# EAGLE schematic extruder-controller (EAGLE 5.06)
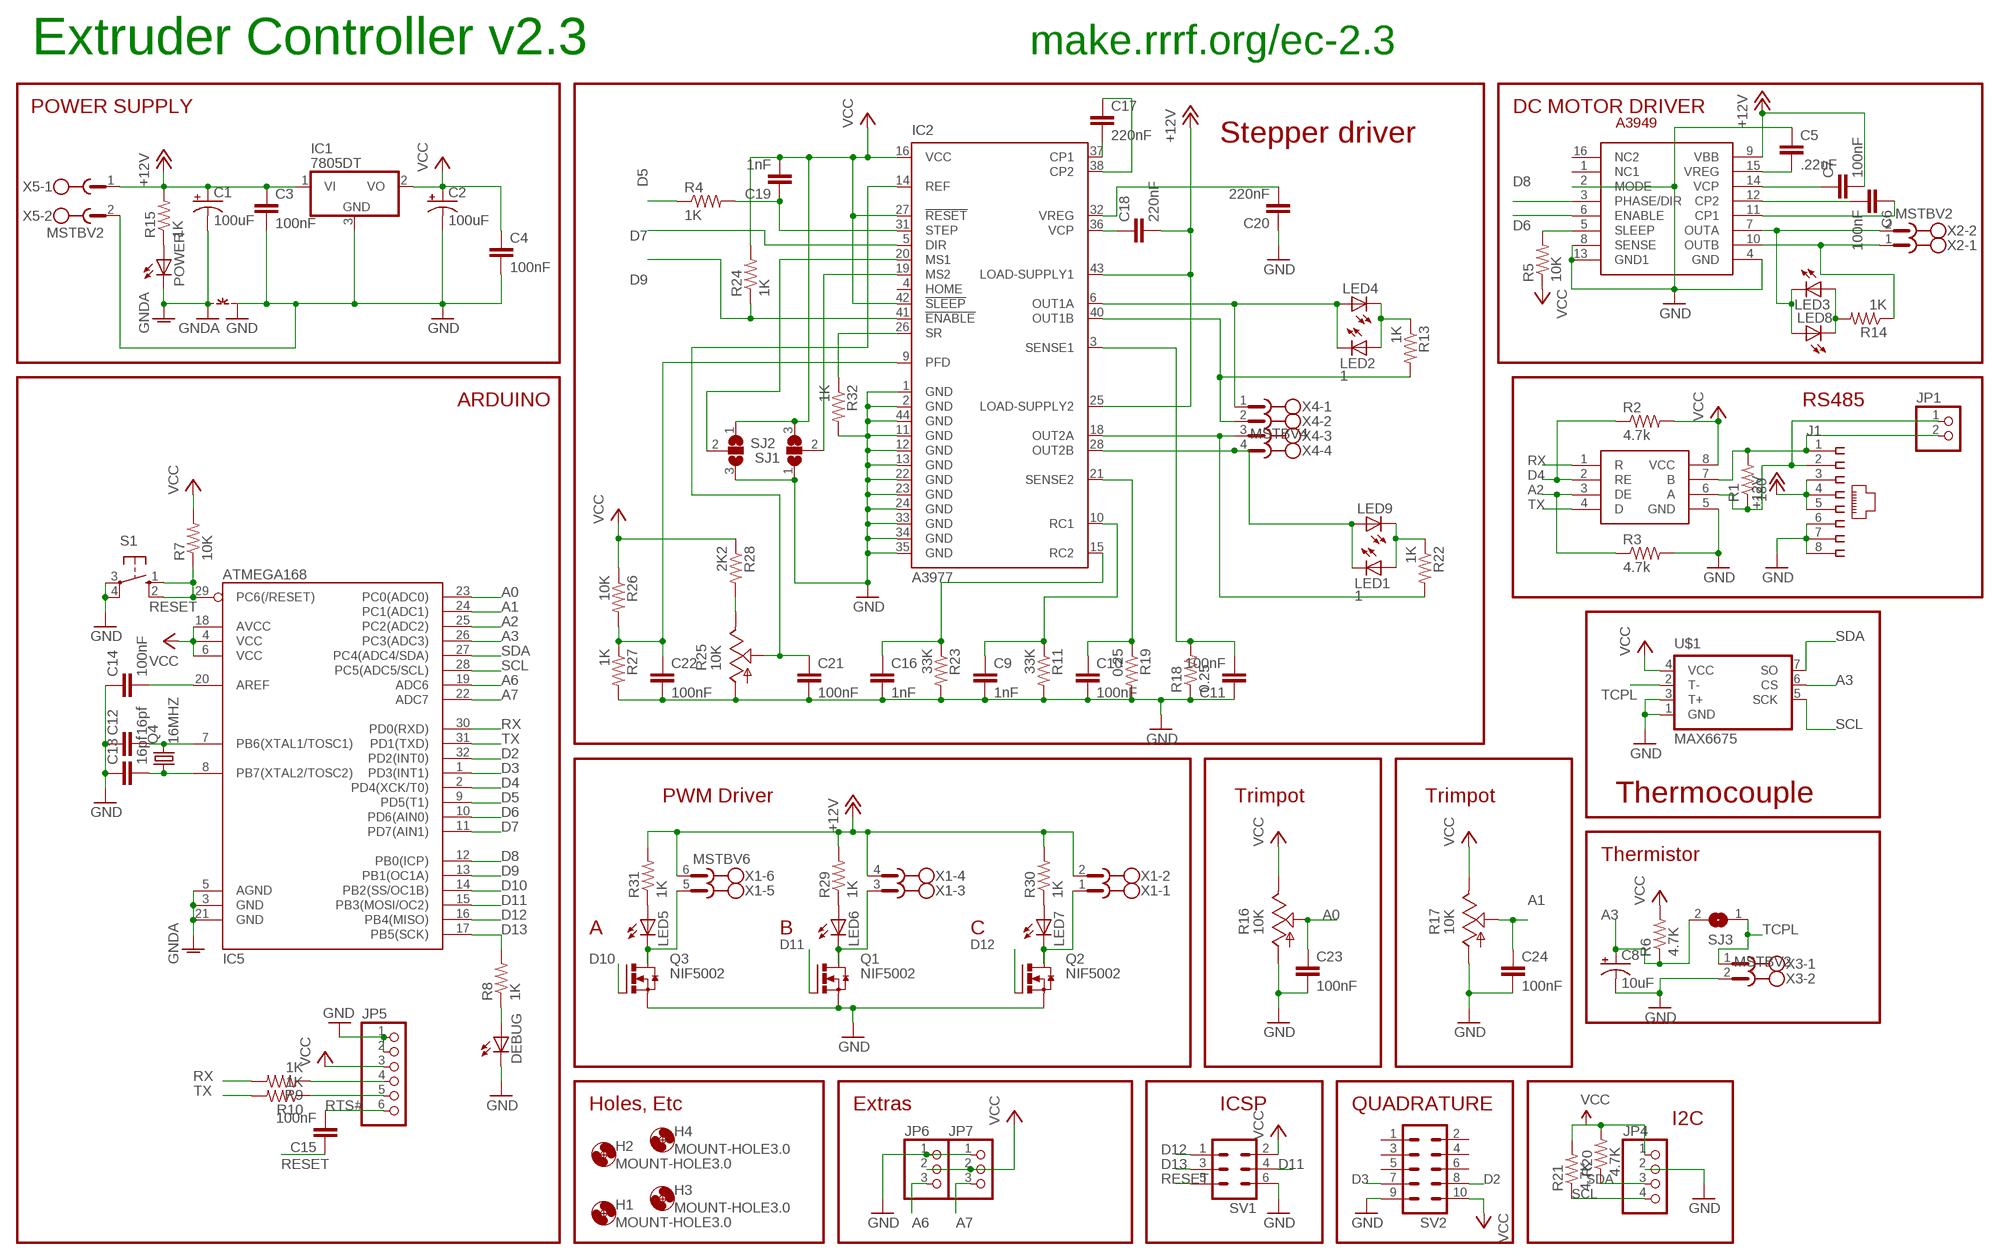
[diagram p0: schematic, sheet 1]

## Parts
C1  100uF  CPOL-USUD-10X10  [UD-10X10_NICHICON]
C2  100uF  CPOL-USUD-10X10  [UD-10X10_NICHICON]
C3  100nF  C-EUC1206  [C1206]
C4  100nF  C-EUC1206  [C1206]
C5  .22uF  C-EUC1206K  [C1206K]
C6  100nF  C-EUC1206K  [C1206K]
C7  100nF  C-EUC1206K  [C1206K]
C8  10uF  CPOL-USUD-6,3X5,8  [UD-6,3X5,8_NICHICON]
C9  1nF  C-EUC1206K  [C1206K]
C10  100nF  C-EUC1206K  [C1206K]
C11  100nF  C-EUC1206K  [C1206K]
C12  16pf  C-EUC1206  [C1206]
C13  16pf  C-EUC1206  [C1206]
C14  100nF  C-EUC1206  [C1206]
C15  100nF  C-EUC1206  [C1206]
C16  1nF  C-EUC1206K  [C1206K]
C17  220nF  C-EUC1206K  [C1206K]
C18  220nF  C-EUC1206K  [C1206K]
C19  1nF  C-EUC1206K  [C1206K]
C20  220nF  C-EUC1206K  [C1206K]
C21  100nF  C-EUC1206K  [C1206K]
C22  100nF  C-EUC1206K  [C1206K]
C23  100nF  C-EUC1206K  [C1206K]
C24  100nF  C-EUC1206K  [C1206K]
DEBUG  LEDCHIPLED_1206  [CHIPLED_1206]
H1  MOUNT-HOLE3.0  [3,0]
H2  MOUNT-HOLE3.0  [3,0]
H3  MOUNT-HOLE3.0  [3,0]
H4  MOUNT-HOLE3.0  [3,0]
IC1  7805DT  [TO252]
IC2  A3977  [PLCC44]
IC3  A3949  [SO16W]
IC4  SN75176ASOIC  [SO08]
IC5  ATMEGA168  [TQFP32-08]
J1  520426-4  [520426-4]
JP1  PINHD-1X2  [1X02]
JP4  PINHD-1X4  [1X04]
JP5  PINHD-1X6  [1X06]
JP6  PINHD-1X3  [1X03]
JP7  PINHD-1X3  [1X03]
LED1  1  LEDCHIPLED_1206  [CHIPLED_1206]
LED2  1  LEDCHIPLED_1206  [CHIPLED_1206]
LED3  LEDCHIPLED_1206  [CHIPLED_1206]
LED4  LEDCHIPLED_1206  [CHIPLED_1206]
LED5  LEDCHIPLED_1206  [CHIPLED_1206]
LED6  LEDCHIPLED_1206  [CHIPLED_1206]
LED7  LEDCHIPLED_1206  [CHIPLED_1206]
LED8  LEDCHIPLED_1206  [CHIPLED_1206]
LED9  LEDCHIPLED_1206  [CHIPLED_1206]
POWER  LEDCHIPLED_1206  [CHIPLED_1206]
Q1  NIF5002  N-HEXFET-2D_SOT232-  [SOT223]
Q2  NIF5002  N-HEXFET-2D_SOT232-  [SOT223]
Q3  NIF5002  N-HEXFET-2D_SOT232-  [SOT223]
Q4  16MHZ  CRYSTALHC49S  [HC49/S]
R1  180  R-US_R1206  [R1206]
R2  4.7k  R-US_R1206  [R1206]
R3  4.7k  R-US_R1206  [R1206]
R4  1K  R-US_R1206  [R1206]
R5  10K  R-US_R1206  [R1206]
R6  4.7K  R-US_M1206  [M1206]
R7  10K  R-US_R1206  [R1206]
R8  1K  R-US_R1206  [R1206]
R9  1K  R-US_R1206  [R1206]
R10  1K  R-US_R1206  [R1206]
R11  33K  R-US_R1206  [R1206]
R13  1K  R-US_R1206  [R1206]
R14  1K  R-US_R1206  [R1206]
R15  1K  R-US_R1206  [R1206]
R16  10K  TRIM_US-B25P  [B25P]
R17  10K  TRIM_US-B25P  [B25P]
R18  0.25  R-US_R2512  [R2512]
R19  0.25  R-US_R2512  [R2512]
R20  4.7K  R-US_R1206  [R1206]
R21  4.7K  R-US_R1206  [R1206]
R22  1K  R-US_R1206  [R1206]
R23  33K  R-US_R1206  [R1206]
R24  1K  R-US_R1206  [R1206]
R25  10K  TRIM_US-B25P  [B25P]
R26  10K  R-US_R1206  [R1206]
R27  1K  R-US_R1206  [R1206]
R28  2K2  R-US_R1206  [R1206]
R29  1K  R-US_R1206  [R1206]
R30  1K  R-US_R1206  [R1206]
R31  1K  R-US_M1206  [M1206]
R32  1K  R-US_R1206  [R1206]
S1  10-XX  [B3F-10XX]
SJ1  SJ2W  [SJ_2]
SJ2  SJ2W  [SJ_2]
SJ3  SJ  [SJ]
SV1  ML6  [ML6]
SV2  ML10  [ML10]
U$1  MAX6675  [SO08]
X1  MSTBV6  [MSTBV6]
X2  MSTBV2  [MSTBV2]
X3  MSTBV2  [MSTBV2]
X4  MSTBV4  [MSTBV4]
X5  MSTBV2  [MSTBV2]
~NUDEV~1  GND-GNDA  [GND-GNDA]

## Nets
+12V [power]: C1.+ C3.1 C7.2 C18.2 IC1.1(VI) IC2.25(LOAD-SUPPLY2) IC2.43(LOAD-SUPPLY1) IC3.9(VBB) J1.3 J1.4 J1.5 R15.2 R29.2 R30.2 R31.2 X1.2 X1.4 X1.6 X5.1
A0: C23.1 IC5.23(PC0(ADC0)) R16.S
A1: C24.1 IC5.24(PC1(ADC1)) R17.S
A2: IC4.3(DE) IC5.25(PC2(ADC2)) R3.1
A3: C8.+ IC5.26(PC3(ADC3)) R6.1 SJ3.2 U$1.6(CS)
A6: IC5.19(ADC6) JP6.3
A7: IC5.22(ADC7) JP7.3
D2: IC5.32(PD2(INT0)) SV2.8
D3: IC5.1(PD3(INT1)) SV2.7
D4: IC4.2(RE) IC5.2(PD4(XCK/T0)) R2.1
D5: IC5.9(PD5(T1)) R4.1
D6: IC3.6(ENABLE) IC5.10(PD6(AIN0))
D7: IC2.5(DIR) IC5.11(PD7(AIN1))
D8: IC3.3(PHASE/DIR) IC5.12(PB0(ICP))
D9: IC2.41(!ENABLE) IC5.13(PB1(OC1A)) R24.1
D10: IC5.14(PB2(SS/OC1B)) Q3.1(G)
D11: IC5.15(PB3(MOSI/OC2)) Q1.1(G) SV1.4
D12: IC5.16(PB4(MISO)) Q2.1(G) SV1.1
D13: IC5.17(PB5(SCK)) R8.2 SV1.3
GND [power]: C2.- C3.2 C4.2 C5.1 C8.- C9.2 C10.2 C11.1 C12.1 C13.1 C14.1 C16.2 C20.1 C21.2 C22.2 C23.2 C24.2 DEBUG.C IC1.3(GND) IC2.1(GND) IC2.2(GND) IC2.11(GND) IC2.12(GND) IC2.13(GND) IC2.22(GND) IC2.23(GND) IC2.24(GND) IC2.33(GND) IC2.34(GND) IC2.35(GND) IC2.44(GND) IC3.2(MODE) IC3.4(GND) IC3.8(SENSE) IC3.13(GND1) IC4.5(GND) J1.6 J1.7 J1.8 JP4.2 JP5.1 JP5.2 JP6.1 JP7.1 Q1.3(S) Q2.3(S) Q3.3(S) R3.2 R11.2 R16.A R17.A R18.1 R19.2 R23.2 R25.A R27.2 R32.2 S1.3(P) S1.4(P1) SJ1.1 SJ2.3 SV1.6 SV2.9 U$1.1(GND) U$1.3(T+) X3.2 X5.2 ~NUDEV~1.GND
GNDA: C1.- IC5.3(GND) IC5.5(AGND) IC5.21(GND) POWER.C ~NUDEV~1.GNDA
N$1: IC4.7(B) J1.1 JP1.2 R1.2
N$2: IC4.6(A) J1.2 JP1.1 R1.1
N$3 [motors]: IC2.6(OUT1A) LED2.C LED4.A X4.1
N$4 [motors]: IC2.40(OUT1B) R13.2 X4.2
N$5: C19.1 IC2.31(STEP) R4.2
N$6 [power]: IC3.7(OUTA) LED3.C LED8.A X2.2
N$7: LED2.A LED4.C R13.1
N$8: DEBUG.A R8.1
N$9: C9.1 IC2.10(RC1) R11.1
N$11: C5.2 IC3.15(VREG)
N$12: C16.1 IC2.15(RC2) R23.1
N$13: C6.2 IC3.12(CP2)
N$14: C6.1 IC3.11(CP1)
N$15: C7.1 IC3.14(VCP)
N$16: IC3.5(SLEEP) R5.2
N$17 [motors]: IC3.10(OUTB) R14.1 X2.1
N$18 [motors]: C11.2 IC2.3(SENSE1) R18.2
N$20: C14.2 IC5.20(AREF)
N$21: JP5.5 R10.1
N$22: JP5.4 R9.1
N$23: LED1.A LED9.C R22.1
N$24: LED3.A LED8.C R14.2
N$25: POWER.A R15.1
N$26 [motors]: IC2.28(OUT2B) LED1.C LED9.A X4.4
N$27 [motors]: IC2.18(OUT2A) R22.2 X4.3
N$28: IC2.26(SR) R32.1
N$30 [motors]: C10.1 IC2.21(SENSE2) R19.1
N$31: C12.2 IC5.7(PB6(XTAL1/TOSC1)) Q4.2
N$32: C13.2 IC5.8(PB7(XTAL2/TOSC2)) Q4.1
N$33 [power]: LED7.C Q2.2(D) Q2.4(D) X1.1
N$34 [power]: LED6.C Q1.2(D) Q1.4(D) X1.3
N$35 [power]: LED5.C Q3.2(D) Q3.4(D) X1.5
N$36: C18.1 IC2.36(VCP)
N$37: C20.2 IC2.32(VREG)
N$38: C17.2 IC2.37(CP1)
N$39: C17.1 IC2.38(CP2)
N$41: LED5.A R31.1
N$42: LED6.A R29.1
N$43: LED7.A R30.1
N$45: C22.1 IC2.9(PFD) R26.2 R27.1
N$46: IC2.19(MS2) SJ1.2
N$47: IC2.20(MS1) SJ2.2
N$48: R25.E R28.2
N$49: C21.1 IC2.14(REF) R25.S
RESET: C15.1 IC5.29(PC6(/RESET)) R7.1 S1.1(S) S1.2(S1) SV1.5
RTS#: C15.2 JP5.6
RX: IC4.1(R) IC5.30(PD0(RXD)) R9.2
SCL: IC5.28(PC5(ADC5/SCL)) JP4.4 R21.1 U$1.5(SCK)
SDA: IC5.27(PC4(ADC4/SDA)) JP4.3 R20.1 U$1.7(SO)
TCPL: SJ3.1 U$1.2(T-) X3.1
TX: IC4.4(D) IC5.31(PD1(TXD)) R10.2
VCC: C2.+ C4.1 C19.2 IC1.2(VO) IC2.16(VCC) IC2.27(!RESET) IC2.42(!SLEEP) IC4.8(VCC) IC5.4(VCC) IC5.6(VCC) IC5.18(AVCC) JP4.1 JP5.3 JP6.2 JP7.2 R2.2 R5.1 R6.2 R7.2 R16.E R17.E R20.2 R21.2 R24.2 R26.1 R28.1 SJ1.3 SJ2.1 SV1.2 SV2.10 U$1.4(VCC)
Unconnected: IC2.4(HOME) IC3.1(NC1) IC3.16(NC2) SV2.1 SV2.2 SV2.3 SV2.4 SV2.5 SV2.6

## Notes on the sheet
- make.rrrf.org/ec-2.3
- Extruder Controller v2.3
- POWER SUPPLY | DC MOTOR DRIVER
- Stepper driver
- ARDUINO | RS485
- PWM Driver | Trimpot | Trimpot | Thermocouple
- Thermistor
- A | B | C
- Holes, Etc | Extras | ICSP | QUADRATURE | I2C

## Library data of the parts
C1 C2 C8 = rcl:CPOL-US: POLARIZED CAPACITOR, American symbol
C3-C7 C9-C11 C14 C16-C24 = rcl:C-EU: CAPACITOR, European symbol
C12 C13 C15 = resistor:C-EU: CAPACITOR, European symbol
DEBUG LED1-LED9 POWER = led:LED: LED OSRAM: - CHIPLED LG R971, LG N971, LY N971, LG Q971, LY Q971, LO R971, LY R971 LH N974, LH R974 LS Q976, LO Q976, LY Q976 LO Q996 - Hyper CHIPLED LW Q18S LB Q993, LB Q99A, LB R99A - SideLED LS A670, LO A670, LY A670, LG A670, LP A670 LB A673, LV A673, LT A673, LW A673 LH A674 LY A675 LS A676, LA A676, LO A676, LY A676, LW A676 LS A679, LY A679, LG A679 - Hyper Micro SIDELED® LS Y876, LA Y876, LO Y876, LY Y876 LT Y87S - SmartLED LW L88C, LW L88S LB L89C, LB L89S, LG L890 LS L89K, LO L89K, LY L89K LS L896, LA L896, LO L896, LY L896 - TOPLED LS T670, LO T670, LY T670, LG T670, LP T670 LSG T670, LSP T670, LSY T670, LOP T670, LYG T670 LG T671, LOG T671, LSG T671 LB T673, LV T673, LT T673, LW T673 LH T674 LS T676, LA T676, LO T676, LY T676, LB T676, LH T676, LSB T676, LW T676 LB T67C, LV T67C, LT T67C, LS T67K, LO T67K, LY T67K, LW E67C LS E67B, LA E67B, LO E67B, LY E67B, LB E67C, LV E67C, LT E67C LW T67C LS T679, LY T679, LG T679 LS T770, LO T770, LY T770, LG T770, LP T770 LB T773, LV T773, LT T773, LW T773 LH T774 LS E675, LA E675, LY E675, LS T675 LS T776, LA T776, LO T776, LY T776, LB T776 LHGB T686 LT T68C, LB T68C - Hyper Mini TOPLED® LB M676 - Mini TOPLED Santana® LG M470 LS M47K, LO M47K, LY M47K Source: http://www.osram.convergy.de - LUMILED® LXK2-PW12-R00, LXK2-PW12-S00, LXK2-PW14-U00, LXK2-PW14-V00 LXK2-PM12-R00, LXK2-PM12-S00, LXK2-PM14-U00 LXK2-PE12-Q00, LXK2-PE12-R00, LXK2-PE12-S00, LXK2-PE14-T00, LXK2-PE14-U00 LXK2-PB12-K00, LXK2-PB12-L00, LXK2-PB12-M00, LXK2-PB14-N00, LXK2-PB14-P00, LXK2-PB14-Q00 LXK2-PR12-L00, LXK2-PR12-M00, LXK2-PR14-Q00, LXK2-PR14-R00 LXK2-PD12-Q00, LXK2-PD12-R00, LXK2-PD12-S00 LXK2-PH12-R00, LXK2-PH12-S00 LXK2-PL12-P00, LXK2-PL12-Q00, LXK2-PL12-R00 Source: www.luxeon.com
H1-H4 = holes:MOUNT-HOLE: MOUNTING HOLE with drill center marker
IC1 = linear:78*: Positive VOLTAGE REGULATOR Source: http://cache.national.com/ds/LM/LM78L05.pdf http://www.fairchildsemi.com/ds/LM/LM7805.pdf
IC2 = allegro:A3977: MICROSTEPPING DMOS DRIVER WITH TRANSLATOR Source: 3977.pdf
IC3 = reprap:A3949
IC4 = reprap:SN75176A
IC5 = SparkFun:ATMEGA168
J1 = con-amp:520426-4: AMP connector
JP1 = pinhead:PINHD-1X2: PIN HEADER
JP4 = pinhead:PINHD-1X4: PIN HEADER
JP5 = pinhead:PINHD-1X6: PIN HEADER
JP6 JP7 = pinhead:PINHD-1X3: PIN HEADER
Q1-Q3 = transistor-power:N-HEXFET-2D_?-*: HEXFET® Power MOSFET 2 Drain connects http://www.irf.com/product-info/datasheets/data/irll014n.pdf
Q4 = crystal:CRYSTAL: CRYSTAL
R1-R3 R5 R7-R10 R15 = resistor:R-US_: RESISTOR, American symbol
R4 R6 R11 R13 R14 R18-R24 R26-R32 = rcl:R-US_: RESISTOR, American symbol
R16 R17 R25 = pot:TRIM_US-: POTENTIOMETER
S1 = switch-omron:10-XX: OMRON SWITCH
SJ1 SJ2 = jumper:SJ2W: SMD solder JUMPER
SJ3 = jumper:SJ: SMD solder JUMPER
SV1 = con-harting-ml:ML6: HARTING
SV2 = con-harting-ml:ML10: HARTING
U$1 = reprap:MAX6675: K-type thermocouple amplifier and a->d converter
X1 = con-phoenix-508:MSTBV6: PHOENIX
X2 X3 X5 = con-phoenix-508:MSTBV2: PHOENIX
X4 = con-phoenix-508:MSTBV4: PHOENIX
~NUDEV~1 = supply1:GND-GNDA: Example of GND--GNDA NET-Connetor for more info see description in package

## Net classes
0 default: width 0.305 mm
1 power: width 1.27 mm
2 motors: width 0.762 mm